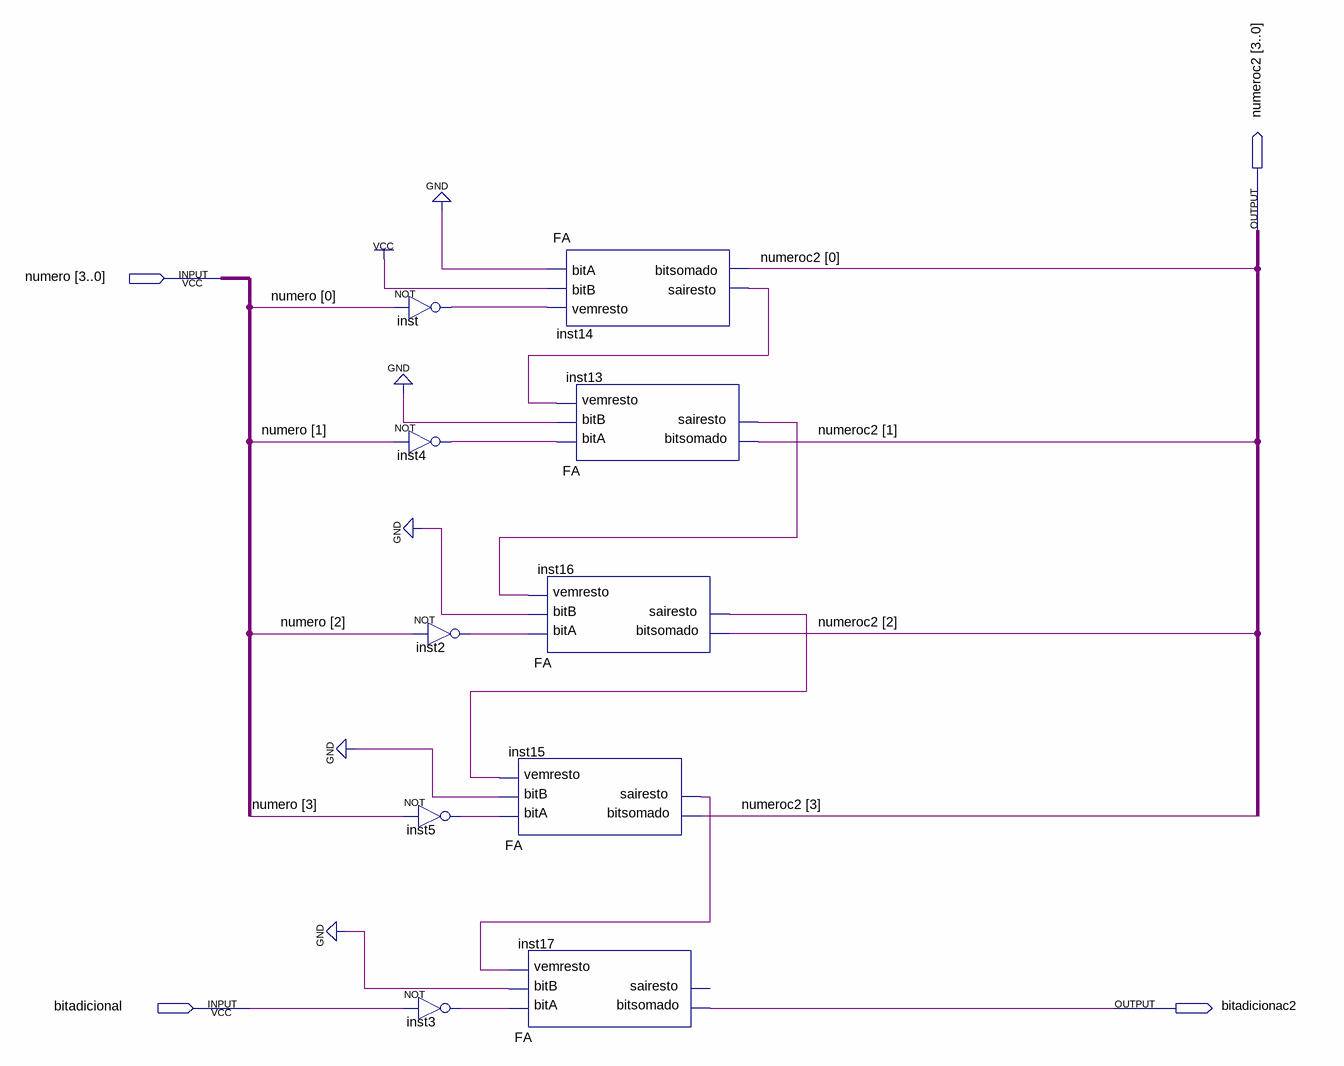
[diagram p0: schematic sheet]
// Quartus schematic complmentoa2tipo2.bdf as structural Verilog: 10 symbols, 4 pins
module complmentoa2tipo2 (
  input  [3:0] numero,
  input  bitadicional,
  output [3:0] numeroc2,
  output bitadicionac2
);

  wire inst2_out, inst3_out, inst4_out, inst5_out, inst13_sairesto, inst14_sairesto, inst15_sairesto,
       inst16_sairesto, inst_out;

  not inst (inst_out, numero[0]);
  not inst4 (inst4_out, numero[1]);
  not inst2 (inst2_out, numero[2]);
  not inst5 (inst5_out, numero[3]);
  not inst3 (inst3_out, bitadicional);
  FA inst16 (
    .bitA(inst2_out), .bitB(1'b0), .vemresto(inst13_sairesto), .bitsomado(numeroc2[2]),
    .sairesto(inst16_sairesto));
  FA inst15 (
    .bitA(inst5_out), .bitB(1'b0), .vemresto(inst16_sairesto), .bitsomado(numeroc2[3]),
    .sairesto(inst15_sairesto));
  FA inst17 (.bitA(inst3_out), .bitB(1'b0), .vemresto(inst15_sairesto), .bitsomado(bitadicionac2));  // open: sairesto
  FA inst14 (.bitA(1'b0), .bitB(1'b1), .vemresto(inst_out), .bitsomado(numeroc2[0]), .sairesto(inst14_sairesto));
  FA inst13 (
    .bitA(inst4_out), .bitB(1'b0), .vemresto(inst14_sairesto), .bitsomado(numeroc2[1]),
    .sairesto(inst13_sairesto));
endmodule
